# EAGLE design Rad-detector (EAGLE 6.0)
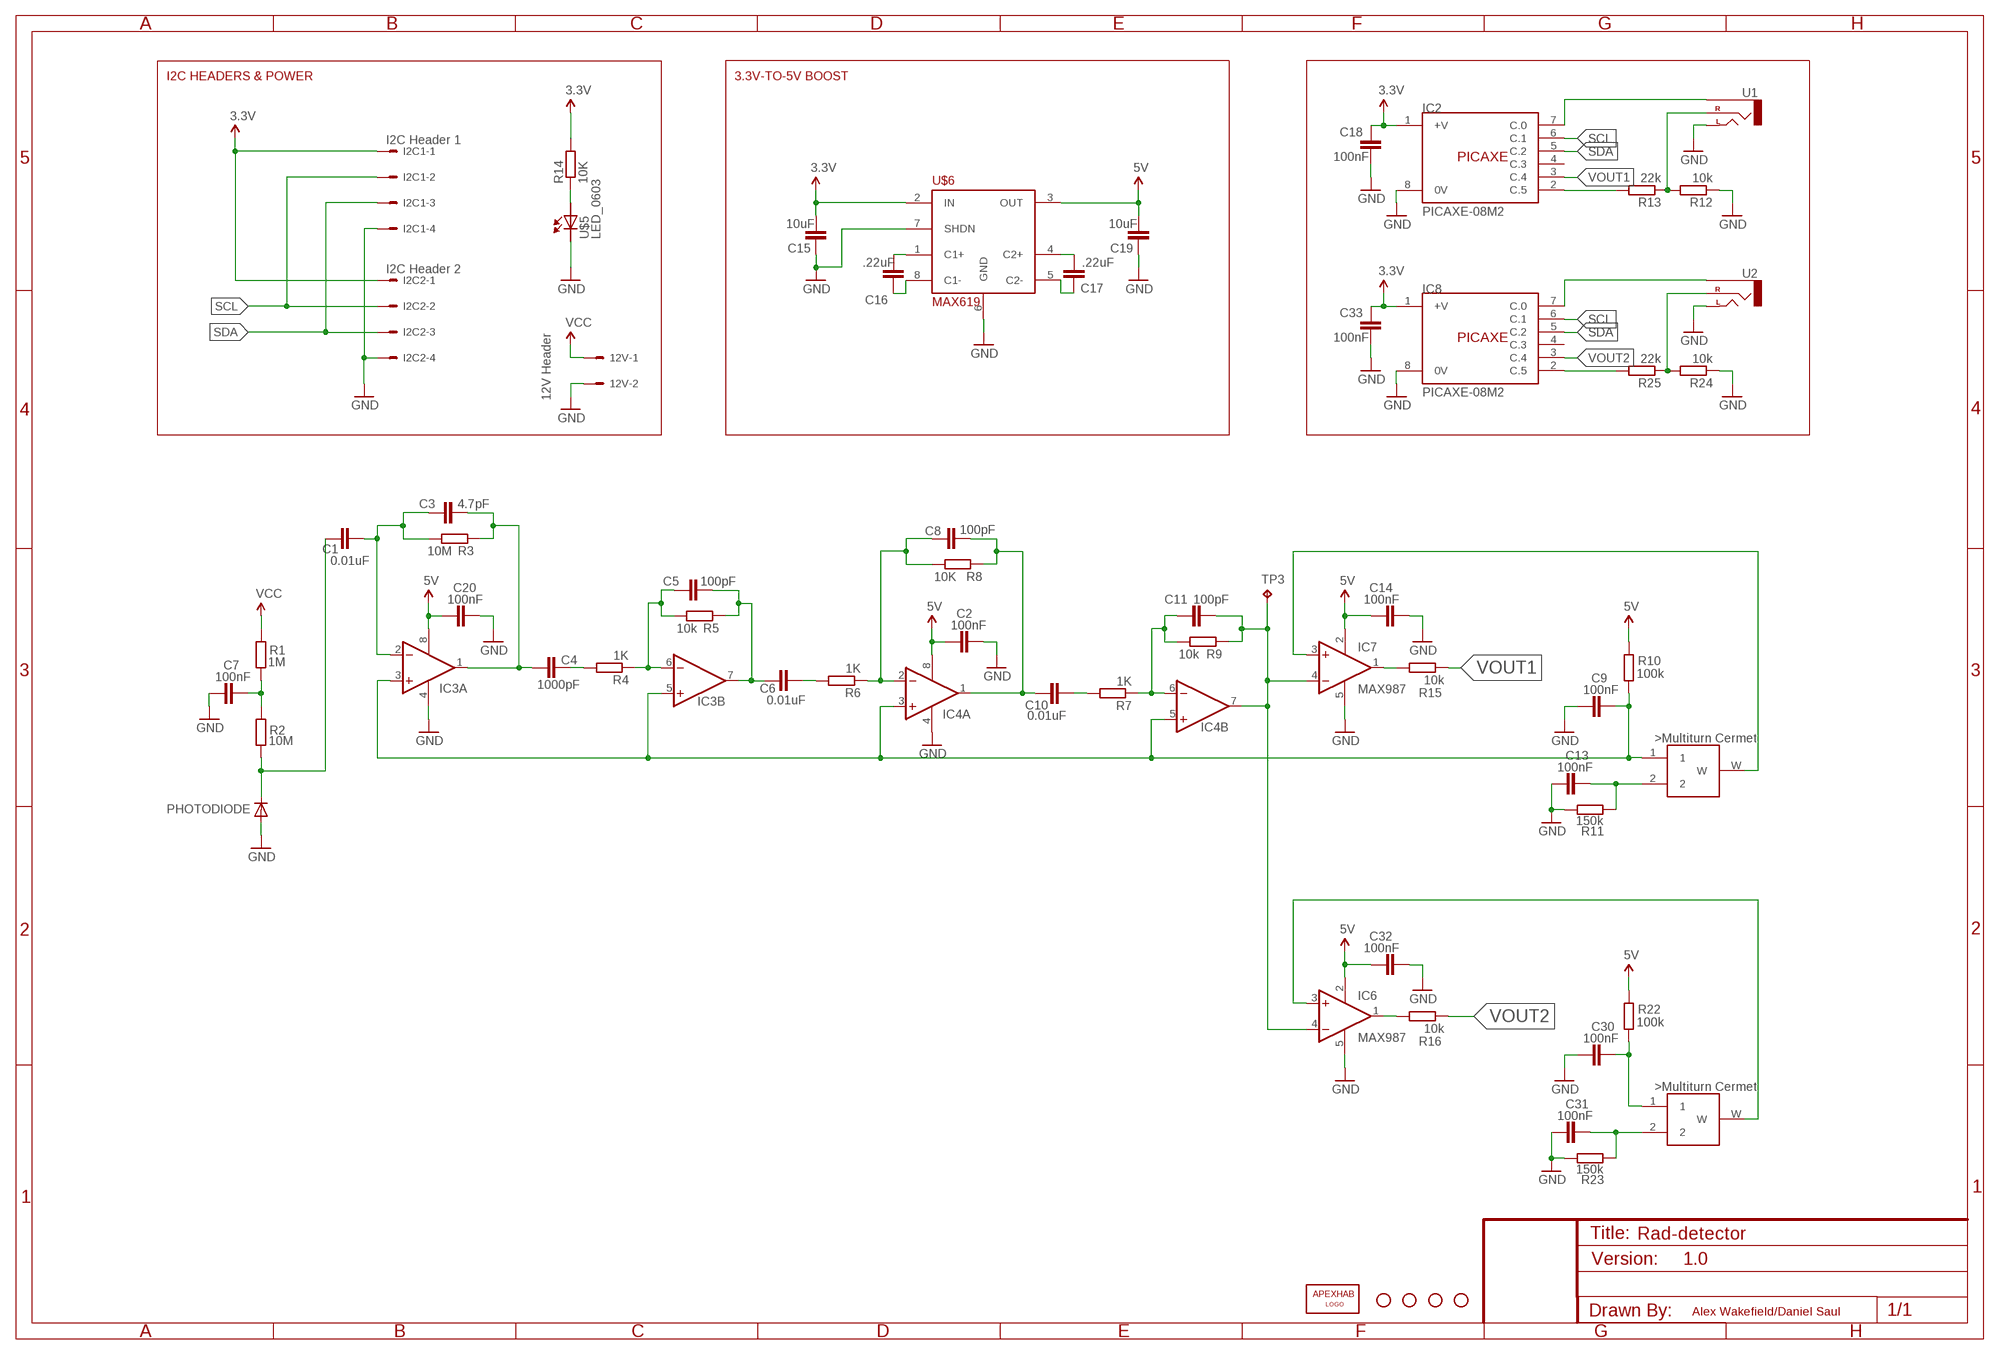
[diagram p0: schematic, sheet 1, part 1 of 2]
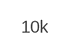
[diagram p1: schematic, sheet 1, part 2 of 2]

## Parts
12V  12V Header  22-27-2021-02  [6410-02]
C1  0.01uF  C-EUC0805  [C0805]
C2  100nF  C-EUC0805  [C0805]
C3  4.7pF  C-EUC0805  [C0805]
C4  1000pF  C-EUC0805  [C0805]
C5  100pF  C-EUC0805  [C0805]
C6  0.01uF  C-EUC0805  [C0805]
C7  100nF  C-EUC0805  [C0805]
C8  100pF  C-EUC0805  [C0805]
C9  100nF  C-EUC0805  [C0805]
C10  0.01uF  C-EUC0805  [C0805]
C11  100pF  C-EUC0805  [C0805]
C13  100nF  C-EUC0805  [C0805]
C14  100nF  C-EUC0805  [C0805]
C15  10uF  C-EUC0805  [C0805]
C16  .22uF  C-EUC0805  [C0805]
C17  .22uF  C-EUC0805  [C0805]
C18  100nF  C-EUC0805  [C0805]
C19  10uF  C-EUC0805  [C0805]
C20  100nF  C-EUC0805  [C0805]
C30  100nF  C-EUC0805  [C0805]
C31  100nF  C-EUC0805  [C0805]
C32  100nF  C-EUC0805  [C0805]
C33  100nF  C-EUC0805  [C0805]
I2C1  I2C Header 1  22-27-2041-04  [6410-04]
I2C2  I2C Header 2  22-27-2041-04  [6410-04]
IC2  PICAXE-08M2  [SOIC8]
IC3  max4477  CA3240ED  [SO08]
IC4  <AX4477  CA3240ED  [SO08]
IC6  MAX987  MCP601R  [SOT23-5]
IC7  MAX987  MCP601R  [SOT23-5]
IC8  PICAXE-08M2  [SOIC8]
JP1  APEXHAB-LOGO_APEX  [APEX-LOGO]
JP2  STAND-OFF  [STAND-OFF]
JP3  STAND-OFF  [STAND-OFF]
JP4  STAND-OFF  [STAND-OFF]
JP5  STAND-OFF  [STAND-OFF]
PHOTODIODE  DIODE-D-2.5  [D-2.5]
R1  1M  R-EU_R0805  [R0805]
R2  10M  R-EU_R0805  [R0805]
R3  10M  R-EU_R0805  [R0805]
R4  1K  R-EU_R0805  [R0805]
R5  10k  R-EU_R0805  [R0805]
R6  1K  R-EU_R0805  [R0805]
R7  1K  R-EU_R0805  [R0805]
R8  10K  R-EU_R0805  [R0805]
R9  10k  R-EU_R0805  [R0805]
R10  100k  R-EU_R0805  [R0805]
R11  150k  R-EU_R0805  [R0805]
R12  10k  R-EU_R0805  [R0805]
R13  22k  R-EU_R0805  [R0805]
R14  10K  R-EU_R0805  [R0805]
R15  10k  R-EU_R0805  [R0805]
R16  10k  R-EU_R0805  [R0805]
R22  100k  R-EU_R0805  [R0805]
R23  150k  R-EU_R0805  [R0805]
R24  10k  R-EU_R0805  [R0805]
R25  22k  R-EU_R0805  [R0805]
TP3  TPTP10SQ  [TP10SQ]
U1  AUDIO-JACKPTH  [AUDIO-JACK]
U2  AUDIO-JACKPTH  [AUDIO-JACK]
U$3  YL_SMT_11-TURN_CERMET_TRIMMER,_10K_0.25W  [YL_SMT_11-TURN_CERMET_TRIMMER,_10K_0.25W]
U$4  YL_SMT_11-TURN_CERMET_TRIMMER,_10K_0.25W  [YL_SMT_11-TURN_CERMET_TRIMMER,_10K_0.25W]
U$5  LED_0603  [CHIPLED_0603]
U$6  MAX619  [SO8]

## Nets
3.3V: C15.2 C18.1 C33.1 I2C1.1 I2C2.1 IC2.1(+V) IC8.1(+V) R14.2 U$6.2(IN)
5V: C2.1 C14.1 C19.2 C20.1 C32.1 IC3.8(P:V+) IC4.8(P:V+) IC6.2(V+) IC7.2(V+) R10.1 R22.1 U$6.3(OUT)
GND: 12V.2 C2.2 C7.1 C9.1 C13.1 C14.2 C15.1 C18.2 C19.1 C20.2 C30.1 C31.1 C32.2 C33.2 I2C1.4 I2C2.4 IC2.8(0V) IC3.4(P:V-) IC4.4(P:V-) IC6.5(V-) IC7.5(V-) IC8.8(0V) PHOTODIODE.A R11.2 R12.1 R23.2 R24.1 U1.TIP(LEFT) U2.TIP(LEFT) U$5.C U$6.6(GND) U$6.7(SHDN)
N$1: C7.2 R1.1 R2.2
N$2: C1.1 PHOTODIODE.C R2.1
N$3: C1.2 C3.1 IC3.2(A:-IN) R3.2
N$4: C4.2 R4.2
N$5: C3.2 C4.1 IC3.1(A:OUT) R3.1
N$6: C5.1 IC3.6(B:-IN) R4.1 R5.2
N$7: C6.2 R6.2
N$8: C5.2 C6.1 IC3.7(B:OUT) R5.1
N$9: C8.1 IC4.2(A:-IN) R6.1 R8.2
N$10: C13.2 R11.1 U$4.2
N$11: C10.2 R7.2
N$12: C11.1 IC4.6(B:-IN) R7.1 R9.2
N$13: IC8.7(C.0) U2.SLEEVE
N$14: IC7.3(+IN) U$4.W
N$15: C30.2 R22.2 U$3.1
N$16: IC7.1(OUT) R15.2
N$17: IC2.2(C.5) R13.2
N$18: IC2.7(C.0) U1.SLEEVE
N$19: IC8.2(C.5) R25.2
N$20: R12.2 R13.1 U1.RING(RIGHT)
N$21: R14.1 U$5.A
N$22: C16.2 U$6.1(C1+)
N$23: C16.1 U$6.8(C1-)
N$24: C17.2 U$6.4(C2+)
N$25: C17.1 U$6.5(C2-)
N$26: C11.2 IC4.7(B:OUT) IC6.4(-IN) IC7.4(-IN) R9.1 TP3.TP
N$27: IC6.1(OUT) R16.2
N$28: C8.2 C10.1 IC4.1(A:OUT) R8.1
N$32: C9.2 IC3.3(A:+IN) IC3.5(B:+IN) IC4.3(A:+IN) IC4.5(B:+IN) R10.2 U$4.1
N$39: C31.2 R23.1 U$3.2
N$40: IC6.3(+IN) U$3.W
N$41: R24.2 R25.1 U2.RING(RIGHT)
SCL: I2C1.2 I2C2.2 IC2.6(C.1) IC8.6(C.1)
SDA: I2C1.3 I2C2.3 IC2.5(C.2) IC8.5(C.2)
VCC: 12V.1 R1.2
VOUT1: IC2.3(C.4) R15.1
VOUT2: IC8.3(C.4) R16.1
Unconnected: IC2.4(C.3) IC8.4(C.3)

## Notes on the sheet
- I2C HEADERS & POWER | 3.3V-TO-5V BOOST
- 10k
- 1.0
- Alex Wakefield/Daniel Saul

## Library data of the parts
12V = apex:22-?-02: CONNECTOR wire to board 2.54 mm (.1 inch) pitch header; OC_FARNELL: unknown; OC_NEWARK: unknown
C1-C11 C13-C20 C30-C33 = rcl:C-EU: CAPACITOR, European symbol
I2C1 I2C2 = apex:22-?-04: CONNECTOR wire to board 2.54 mm (.1 inch) pitch header; OC_FARNELL: unknown; OC_NEWARK: unknown
IC2 IC8 = apex:PICAXE-08M2
IC3 IC4 = linear:CA3240E: OP AMP
IC6 IC7 = linear:MCP601: Single Op Amp 2.7V to 6.0V Single Supply CMOS Source: http://ww1.microchip.com/downloads/en/DeviceDoc/21314g.pdf
JP1 = apex:APEXHAB-LOGO: ApexHAB PCB Logo This is the standard ApexHAB PCB logo.
JP2-JP5 = apex:STAND-OFF: Stand Off This is the mechanical footprint for a #4 phillips button head screw. Use the keepout ring to avoid running the screw head into surrounding components. SKU : PRT-00447
PHOTODIODE = diode:DIODE-: DIODE
R1-R16 R22-R25 = rcl:R-EU_: RESISTOR, European symbol
TP3 = testpad:TP: Test pad
U1 U2 = SparkFun:AUDIO-JACK: 3.5mm Audio Jack Simple 3.5mm common PCB mount audio jack. SKU: PRT-08032
U$3 U$4 = New_maxim _chips:YL_SMT_11-TURN_CERMET_TRIMMER,_10K_0.25W
U$5 = apex:LED: SMD LED
U$6 = !danielparts:MAX619

## Board
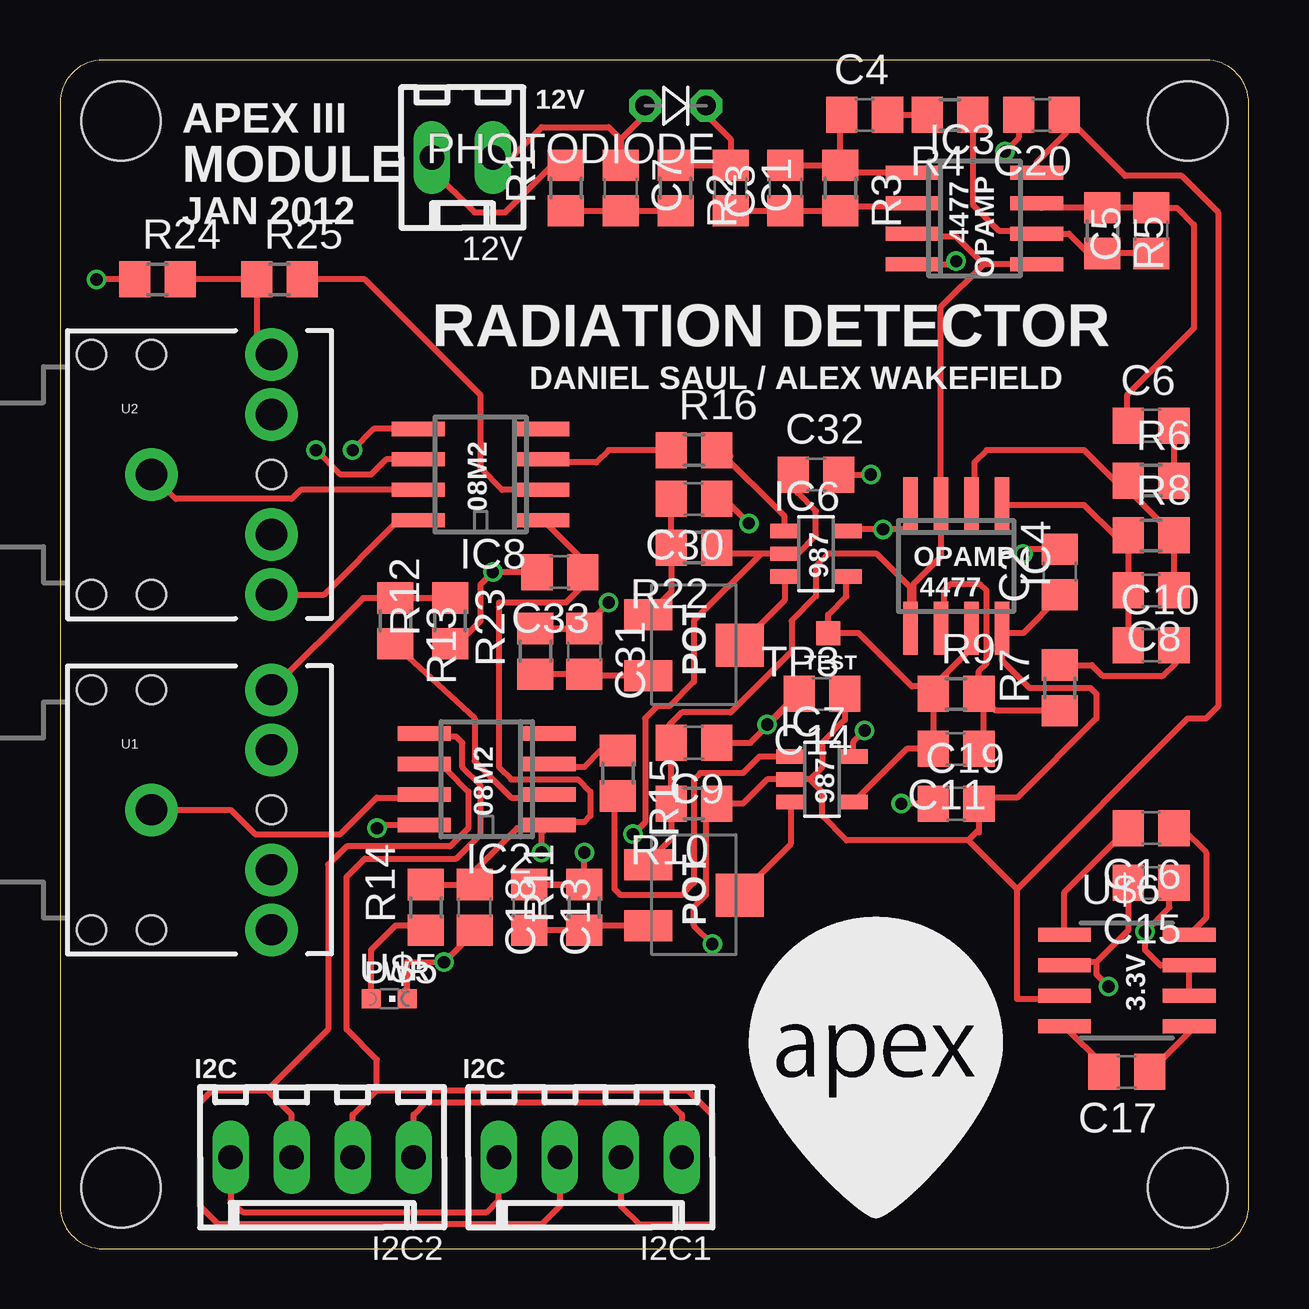
[diagram p2: board, top side]
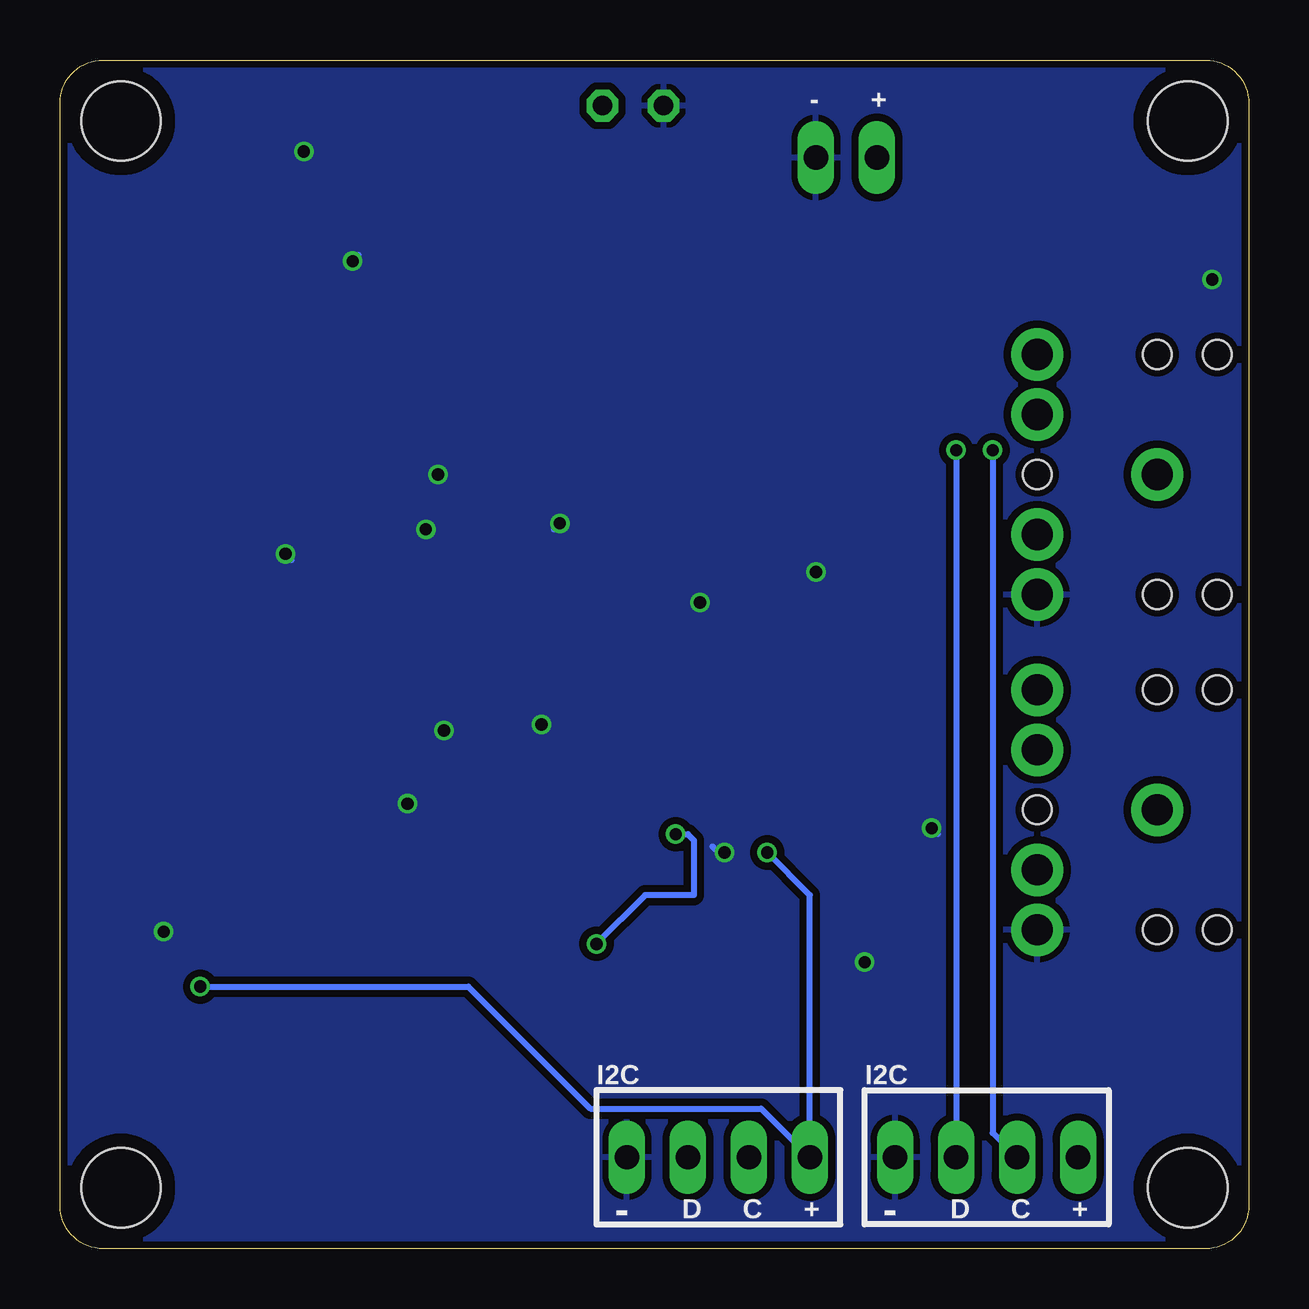
[diagram p3: board, bottom side, seen from below]

Size 49.53 x 49.53 mm. Coordinates in mm from the lower left corner, seen from the top.
Outline: 49.53,1.8 49.53,47.73 arc90 47.73,49.53 1.8,49.53 arc90 0,47.73 0,1.8 arc90 1.8,0 47.73,0 arc90 49.53,1.8
Copper layers (1*16): Top 0.035mm / dielectric 1.5mm / Bottom 0.035mm
Design rules: minimum track width 6mil, minimum drill 12mil, track to track 6mil, track to pad 6mil, pad to pad 6mil, via to via 6mil, smd to smd 0mil, copper to edge 10mil, drill to drill 10mil, minimum pad ring 10mil, minimum via ring 6mil, stop-mask expansion 2mil, vias tented up to drill 100mil, thermal gap 10mil

### Footprints (pad centres in the part's own frame; a part is rotated, then mirrored left to right if it is on the bottom)
6410-02 = drill 1.016 long: 1 1.27,0; 2 -1.27,0
C0805 = smd 1.3 x 1.5: 1 -0.95,0; 2 0.95,0
6410-04 = drill 1.016 long: 1 3.81,0; 2 1.27,0; 3 -1.27,0; 4 -3.81,0
SOIC8 = smd 0.6 x 2.2: 1 -1.905,-2.6; 2 -0.635,-2.6; 3 0.635,-2.6; 4 1.905,-2.6; 5 1.905,2.6; 6 0.635,2.6; 7 -0.635,2.6; 8 -1.905,2.6
SO08 = smd 0.6 x 2.2: 1 -1.905,-2.6; 2 -0.635,-2.6; 3 0.635,-2.6; 4 1.905,-2.6; 5 1.905,2.6; 6 0.635,2.6; 7 -0.635,2.6; 8 -1.905,2.6
SOT23-5 = smd 0.6 x 1.2: 1 -0.95,-1.306; 2 0,-1.306; 3 0.95,-1.306; 4 0.95,1.306; 5 -0.95,1.306
STAND-OFF = hole 3.302: 0,0
D-2.5 = drill 0.813 octagon: A 1.27,0; C -1.27,0
R0805 = smd 1.3 x 1.5: 1 -0.95,0; 2 0.95,0
TP10SQ = smd 1 x 1: TP 0,0
AUDIO-JACK = drill 1.3 pad 2.184: RING 5,5; RSH 5,2.5; SLEEVE 0,0; TIP 5,-5; TSH 5,-2.5 | hole 1.2: 0,5; -2.5,5; -2.5,-5; 0,-5; 5,0
YL_SMT_11-TURN_CERMET_TRIMMER,_10K_0.25W = smd 1.3 x 2: 1 0,-1.9; 2 2.54,-1.9 | smd 1.8 x 2: W 1.27,1.9
CHIPLED_0603 = smd 0.8 x 0.8: A 0,-0.75; C 0,0.75
SO8 = smd 0.6 x 2.2: 1 -1.905,-2.6; 2 -0.635,-2.6; 3 0.635,-2.6; 4 1.905,-2.6; 5 1.905,2.6; 6 0.635,2.6; 7 -0.635,2.6; 8 -1.905,2.6

### Placement (x,y rotation side)
12V  16.76,45.47 180 top
C1  27.94,44.2 270 top
C2  41.66,28.19 90 top
C3  30.23,44.2 90 top
C4  33.53,47.24 0 top
C5  45.47,42.42 90 top
C6  45.47,34.29 0 top
C7  23.37,44.2 270 top
C8  45.47,27.43 180 top
C9  26.42,21.08 180 top
C10  45.47,25.15 0 top
C11  37.34,20.83 180 top
C13  19.56,14.22 270 top
C14  31.75,23.11 180 top
C15  45.47,15.24 180 top
C16  45.47,17.53 180 top
C17  44.45,7.37 180 top
C18  17.27,14.22 270 top
C19  37.34,18.54 0 top
C20  40.89,47.24 180 top
C30  26.42,31.24 180 top
C31  21.84,24.89 270 top
C32  31.5,32.26 0 top
C33  20.83,28.19 180 top
I2C1  22.1,3.81 180 top
I2C2  10.92,3.81 180 top
IC2  17.78,19.56 90 top
IC3  38.1,42.93 270 top
IC4  37.34,28.45 180 top
IC6  31.5,28.96 270 top
IC7  31.75,19.56 270 top
IC8  17.53,32.26 90 top
JP1  28.7,1.27 0 top
JP2  2.54,2.54 180 top
JP3  46.99,2.54 180 top
JP4  46.99,46.99 180 top
JP5  2.54,46.99 180 top
PHOTODIODE  25.65,47.62 180 top
R1  21.08,44.2 90 top
R2  25.65,44.2 270 top
R3  32.51,44.2 270 top
R4  37.08,47.24 180 top
R5  43.43,42.42 270 top
R6  45.47,32 0 top
R7  41.66,23.37 90 top
R8  45.47,29.72 0 top
R9  37.34,23.11 0 top
R10  26.42,18.54 180 top
R11  21.84,14.22 90 top
R12  16.26,26.16 90 top
R13  13.97,26.16 270 top
R14  15.24,14.22 90 top
R15  23.24,19.81 270 top
R16  26.42,33.27 0 top
R22  26.42,29.21 180 top
R23  19.81,24.89 90 top
R24  4.06,40.39 0 top
R25  9.14,40.39 0 top
TP3  32,25.65 180 top
U1  3.81,18.29 0 top
U2  3.81,32.26 0 top
U$3  26.42,26.42 270 top
U$4  26.42,16 270 top
U$5  13.72,10.41 270 top
U$6  44.45,11.18 270 top

### Tracks (layer width: path | path; a pad name or v marks a point on that pad's centre or on a via)
3.3V  (via drill 0.51)
  Top 0.254: C15.2 44.52,13.27 43.18,11.94 | 43.18,11.94 41.98,11.94 U$6.2 | IC8.1 21.78,28.7 C33.1 21.78,27.62 21.08,26.92 18.29,26.92 18.29,20.07 18.8,19.56 21.59,19.56 22.1,19.05 22.1,18.03 21.84,17.78 20.51,17.78 IC2.1 | R14.2 C18.1 17.27,15.75 19.05,17.53 20.25,17.53 IC2.1 | I2C2.1 7.11,2.03 7.62,1.52 17.78,1.52 18.29,2.03 I2C1.1 | v20.07,16.51 20.07,17.34 IC2.1 | 43.18,11.94 43.18,11.43 v43.69,10.92
  Bottom 0.254: v20.07,16.51 18.29,14.73 I2C1.1 20.32,5.84 27.43,5.84 32.51,10.92 v43.69,10.92
5V  (via drill 0.51)
  Top 0.254: C2.1 41.66,27.18 40.13,25.65 39.44,25.65 IC4.8 | C19.2 38.29,17.34 | C19.2 38.29,17.46 37.85,17.02 | 37.85,17.02 32.77,17.02 31.75,18.03 31.75,19.05 31.24,19.56 | 31.24,19.56 IC7.2 29.46,19.56 28.45,18.54 R10.1 26.92,18.1 26.92,14.73 26.42,14.22 26.42,13.46 v27.18,12.7 | C14.1 32.7,22.03 31.75,21.08 31.75,20.07 31.24,19.56 | IC6.2 27.62,28.96 R22.1 | 30.73,31.5 30.73,32.07 C32.1 30.73,32.45 30.73,32.51 30.48,32.26 30.48,31.75 30.73,31.5 | IC4.8 39.24,24.51 40.39,23.37 42.93,23.37 43.18,23.11 43.18,22.1 39.88,18.8 38.54,18.8 C19.2 | IC3.8 40.7,45.27 41.91,46.48 41.91,47.24 C20.1 | 41.66,47.24 C20.1 | C20.1 44.38,44.7 46.74,44.7 48.26,43.18 48.26,22.61 47.75,22.1 46.99,22.1 39.88,14.99 | IC6.2 30.73,28.96 31.5,29.72 31.5,30.73 30.73,31.5 | 39.37,25.98 IC4.8 | U$6.3 41.72,10.41 39.88,10.41 39.88,14.99 | 39.88,14.99 37.85,17.02 | IC6.2 29.21,28.96 26.42,26.16 26.42,23.62 25.4,22.61 24.89,22.61 24.38,22.1 24.38,17.78 v23.88,17.27
  Bottom 0.254: v23.88,17.27 23.37,17.27 23.11,17.02 23.11,14.73 25.15,14.73 v27.18,12.7
GND  (via drill 0.51)
  Top 0.254: 12V.2 18.8,45.47 20.07,46.74 22.86,46.74 23.37,46.23 | 23.37,46.23 C7.1 | PHOTODIODE.A 24.38,47.24 23.37,46.23 | IC4.4 35.56,30.92 35.56,29.97 v34.29,29.97 32.87,29.97 IC6.5 | U$6.6 U$6.7 45.85,11.81 45.21,12.45 v45.21,13.21 46.23,14.22 46.23,15.05 C15.1 | C9.1 28.77,21.08 C14.2 30.73,23.11 v29.46,21.84 | U2.TIP 11,27.26 13.97,30.23 14.8,30.23 IC8.8 | I2C2.4 14.73,5.59 15.24,6.1 25.4,6.1 25.91,5.59 I2C1.4 | C19.1 v35.05,18.54 | IC7.5 33.06,21.12 v33.53,21.59 | C2.2 40.32,29.14 v40.13,28.96 | C32.2 v33.78,32.26 | IC3.4 37.21,41.02 v37.34,41.15 | C20.2 39.94,46.29 v39.37,45.72 | C30.1 27.69,31.24 v28.7,30.23 | U$5.C 14.47,11.95 v16,11.94 17.27,13.21 C18.2 | IC2.8 13.34,17.65 v13.21,17.53 | R11.2 C13.1 21.78,15.17 21.84,15.24 v21.84,16.51 | R24.1 v1.52,40.39 | C31.1 R23.2 21.78,25.84 v22.86,26.92 | C33.2 v18.03,28.19 17.53,27.69 17.53,26.16 16.58,25.21 R12.1
  Bottom 0.254: v45.21,13.21 45.21,12.95 | v35.05,18.54 34.8,18.54 | v33.53,21.59 33.78,21.59 | v29.46,21.84 29.21,21.84 | v40.13,28.96 39.88,28.7 | v34.29,29.97 34.29,30.23 | v33.78,32.26 34.04,32.26 | v37.34,41.15 37.08,41.4 | v39.37,45.72 39.37,45.97 | v28.7,30.23 28.96,29.97 | v16,11.94 16,11.68 | v13.21,17.53 12.95,17.27 | v21.84,16.51 22.1,16.51 22.35,16.76 | v1.52,40.39 1.52,40.64 | v22.86,26.92 22.86,27.18 | v18.03,28.19 18.03,28.45
  pour Bottom (isolate 0.305): 49.78,49.53 49.78,0 50.04,-0.25 0.25,-0.25 0,0 0,49.53
N$1
  Top 0.254: R1.1 C7.2 R2.2
N$2
  Top 0.254: R2.1 C1.1 27.94,46.23 26.92,47.24 PHOTODIODE.C
N$3
  Top 0.254: C1.2 C3.1 R3.2 32.58,43.25 32.51,43.43 35.37,43.43 IC3.2
N$4
  Top 0.254: C4.2 R4.2
N$5
  Top 0.254: IC3.1 32.83,44.83 R3.1 | C3.2 R3.1 | R3.1 32.51,47.43 C4.1
N$6
  Top 0.254: C5.1 R5.2 43.37,41.4 42.93,41.4 42.04,42.29 IC3.6 40.57,42.42 39.12,42.42 38.03,43.5 R4.1
N$7
  Top 0.254: C6.2 46.42,32.07 46.48,32 R6.2
N$8
  Top 0.254: IC3.7 40.89,43.37 R5.1 C5.2 46.55,43.37 47.24,42.67 47.24,38.35 44.45,35.56 44.45,34.36 C6.1
N$9
  Top 0.254: R6.1 44.52,31.62 | 44.52,31.62 R8.2 C8.1 | 44.52,31.62 44.33,31.62 42.67,33.27 38.61,33.27 38.1,32.77 38.1,31.18 IC4.2
N$10
  Top 0.254: U$4.2 22.03,13.46 R11.1 C13.2
N$11
  Top 0.254: R7.2 42.99,24.32 43.43,23.88 45.97,23.88 46.48,24.38 46.48,25.15 C10.2
N$12
  Top 0.254: R9.2 38.48,22.93 38.48,21.02 C11.1 | R9.2 38.29,24.06 38.61,24.38 38.61,27.43 38.35,27.69 37.08,27.69 36.83,27.43 36.83,25.98 IC4.6 | R7.1 38.98,22.42 R9.2
N$13
  Top 0.254: IC8.7 10.03,31.62 9.65,31.24 4.83,31.24 U2.SLEEVE
N$14
  Top 0.254: IC7.3 30.44,16.86 U$4.W
N$15
  Top 0.254: C30.2 R22.2 25.47,27.37 U$3.1
N$16
  Top 0.254: IC7.1 29.14,20.51 28.45,19.81 26.67,19.81 26.42,19.56 26.42,15.24 25.91,14.73 23.37,14.73 23.11,14.99 23.11,18.54 23.37,18.8 R15.2
N$17
  Top 0.254: R13.2 13.97,25.15 17.27,22.1 17.27,20.32 18.8,18.8 20.25,18.8 IC2.2
N$18
  Top 0.254: U1.SLEEVE 7.11,18.29 8.13,17.27 11.68,17.27 13.21,18.8 15.24,18.8 | 14.99,19.05 15.18,18.86 | 15.24,19.05 15.24,18.8 | IC2.7 15.18,18.86 | 15.18,18.86 15.24,18.8
N$19
  Top 0.254: IC8.2 18.41,31.62 17.53,32.51 17.53,35.56 12.7,40.39 R25.2
N$20
  Top 0.254: R12.2 R13.1 12.63,27.11 U1.RING
N$21
  Top 0.254: R14.1 15.04,13.47 15,13.47 14.99,13.46 | 15.24,13.46 14.99,13.46 | 14.99,13.46 13.97,13.46 12.95,12.45 12.95,10.41 U$5.A
N$22
  Top 0.254: U$6.1 41.85,14.86 C16.2
N$23
  Top 0.254: C16.1 46.74,17.53 47.75,16.51 47.75,13.78 U$6.8
N$24
  Top 0.254: C17.2 43.5,7.62 U$6.4
N$25
  Top 0.254: U$6.5 47.05,9.02 C17.1
N$26
  Top 0.254: 36.39,23.43 R9.1 C11.2 35.28,20.83 IC7.4 | 36.39,23.43 37.85,24.89 37.85,25.72 IC4.7 | 36.39,23.43 35.49,23.43 33.27,25.65 TP3.TP 32,26.42 32.77,27.18 32.77,27.97 IC6.4
N$27
  Top 0.254: IC6.1 30.19,30.52 27.43,33.27 | 27.43,33.27 27.69,33.27 27.94,33.02 | R16.2 27.43,33.27
N$28
  Top 0.254: C10.1 C8.2 R8.1 43.94,29.72 42.67,30.99 39.3,30.99 IC4.1
N$32
  Top 0.254: IC3.5 38.48,41.02 | 38.48,41.02 37.34,42.16 35.63,42.16 IC3.3 | 38.48,41.02 36.7,39.24 IC4.3 36.7,28.83 35.56,27.69 35.56,25.98 IC4.5 35.43,27.56 34.04,28.96 32,28.96 31.5,28.45 31.5,27.18 30.48,26.16 30.48,24.89 27.94,22.35 25.91,22.35 25.4,21.84 25.4,21.15 C9.2 R10.2 25.47,17.08 24.51,16.13 | 24.51,16.13 24.38,16 | U$4.1 24.52,16.12 24.51,16.13
N$39
  Top 0.254: U$3.2 21.91,23.88 C31.2 R23.1
N$40
  Top 0.254: IC6.3 30.19,27.02 U$3.W
N$41
  Top 0.254: R24.2 R25.1 8.19,37.87 U2.RING
SCL  (via drill 0.51)
  Top 0.254: I2C2.2 9.65,5.59 8.64,6.6 | I2C1.2 20.83,1.78 20.07,1.02 6.6,1.02 5.84,1.78 5.84,6.1 6.35,6.6 8.64,6.6 | IC2.6 16.13,20.19 16.13,19.94 17.02,19.05 17.02,17.53 16.26,16.76 11.94,16.76 11.18,16 11.18,9.14 8.64,6.6 | IC8.6 13.59,32.89 12.95,32.26 11.68,32.26 v10.67,33.27
  Bottom 0.254: v10.67,33.27 10.67,4.83 I2C2.2
SDA  (via drill 0.51)
  Top 0.254: I2C2.3 12.19,5.59 13.21,6.6 | 13.21,6.6 26.16,6.6 27.18,5.59 27.18,1.02 24.13,1.02 23.37,1.78 I2C1.3 | 13.21,6.6 13.21,7.87 11.94,9.14 11.94,15.49 12.7,16.26 16.51,16.26 17.53,17.27 17.53,19.3 16.76,20.07 16.76,21.08 16.51,21.34 15.31,21.34 IC2.5 | IC8.5 13.08,34.16 v12.19,33.27
  Bottom 0.254: v12.19,33.27 I2C2.3
VCC
  Top 0.254: 12V.1 15.49,44.96 17.27,43.18 18.54,43.18 20.57,45.21 21.02,45.21 R1.2
VOUT1
  Top 0.254: R15.1 22.54,20.76 21.84,20.07 20.51,20.07 IC2.3
VOUT2
  Top 0.254: R16.1 22.86,33.27 22.35,32.77 20.25,32.77 IC8.3

### Text on the board
tPlace: 12V | APEX III | OPAMP | MODULE | JAN 2012 | 4477 | RADIATION DETECTOR | DANIEL SAUL / ALEX WAKEFIELD | 08M2 | 987 | OPAMP | 4477 | POT | TEST | 987 | 08M2 | POT | PWR | 3.3V | I2C | I2C
bPlace: + | - | I2C | I2C | + | C | D | - | + | C | D | -